# EAGLE design caps-lock-buzzer (EAGLE 7.7.0)
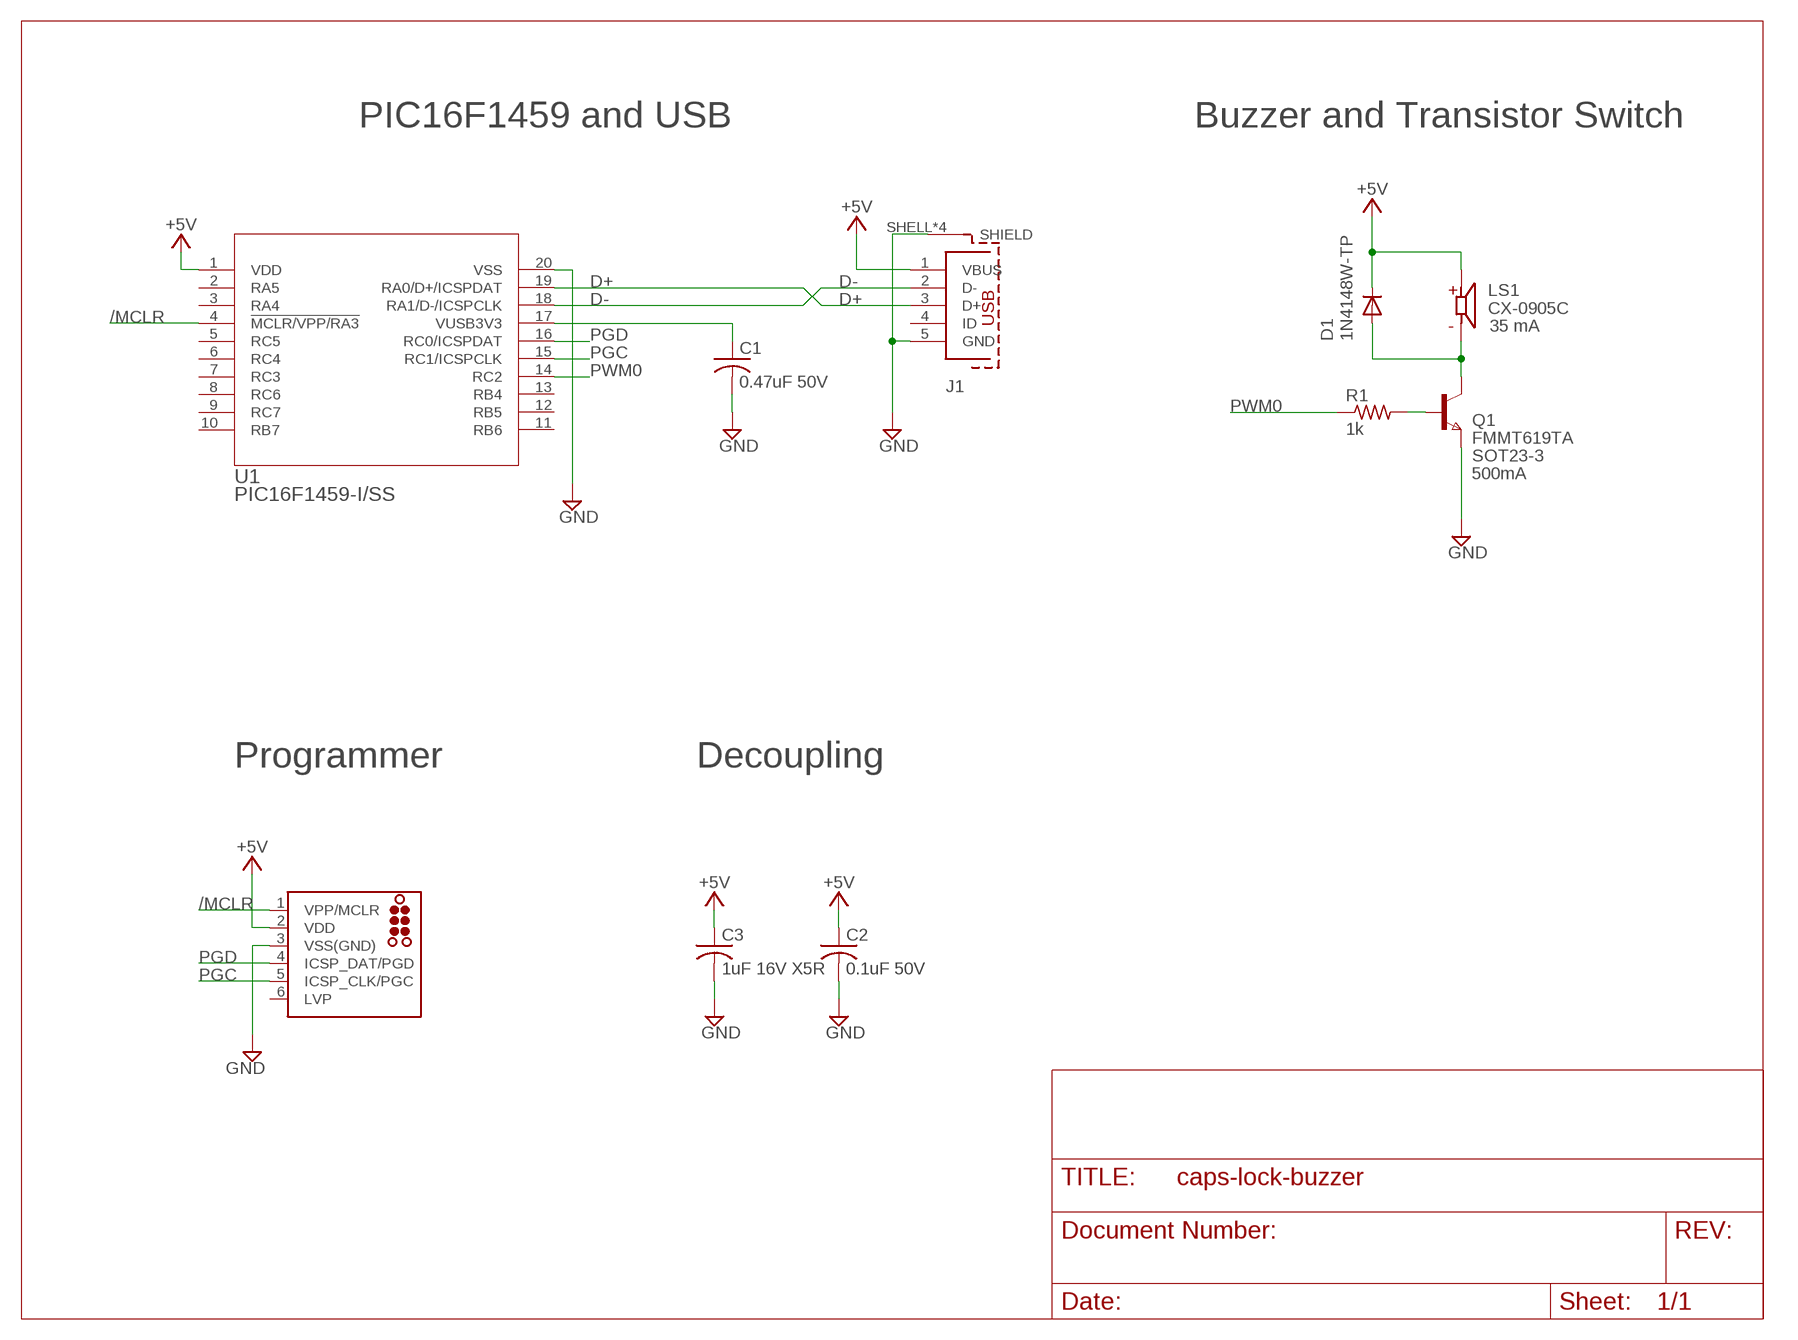
[diagram p0: schematic, sheet 1]

## Parts
C1  0.47uF 50V  C-USC1206K  [C1206K]
C2  0.1uF 50V  C-USC1206K  [C1206K]
C3  1uF 16V X5R  C-USC1210  [C1210]
D1  1N4148W-TP  DIODE-SOD123  [SOD123]
J1  629105136821  [629105136821]
J3  TC2030-MCP-NL  [TC2030-MCP-NL]
LS1  CX-0905C  [CUI_CX-0905C]
Q1  FMMT619TA  NPNSOT23  [SOT-23]
R1  1k  R-US_R0805  [R0805]
U1  PIC16F1459-I/SS  [SSOP20_MC]

## Nets
+5V: C2.1 C3.1 D1.C J1.1(VBUS) J3.2(VDD) LS1.P U1.1(VDD)
/MCLR: J3.1(VPP/MCLR) U1.4(!MCLR/VPP/RA3)
D+: J1.3(D+) U1.19(RA0/D+/ICSPDAT)
D-: J1.2(D-) U1.18(RA1/D-/ICSPCLK)
GND: C1.2 C2.2 C3.2 J1.5(GND) J1.SHELL1(SHIELD) J1.SHELL2(SHIELD) J1.SHELL3(SHIELD) J1.SHELL(SHIELD) J3.3(VSS(GND)) Q1.2(E) U1.20(VSS)
N$16: Q1.3(B) R1.2
OUT0: D1.A LS1.N Q1.1(C)
PGC: J3.5(ICSP_CLK/PGC) U1.15(RC1/ICSPCLK)
PGD: J3.4(ICSP_DAT/PGD) U1.16(RC0/ICSPDAT)
PWM0: R1.1 U1.14(RC2)
VUSB: C1.1 U1.17(VUSB3V3)
Unconnected: J1.4(ID) J3.6(LVP) U1.2(RA5) U1.3(RA4) U1.5(RC5) U1.6(RC4) U1.7(RC3) U1.8(RC6) U1.9(RC7) U1.10(RB7) U1.11(RB6) U1.12(RB5) U1.13(RB4)

## Notes on the sheet
- PIC16F1459 and USB | Buzzer and Transistor Switch
- 35 mA
- SOT23-3
- 500mA
- Programmer | Decoupling

## Library data of the parts
C1 = rcl:C-US: CAPACITOR, American symbol; MFR: KEMET; MFR_PART_NO: C1206C474K5RACTU
C2 = rcl:C-US: CAPACITOR, American symbol; MFR: KEMET; MFR_PART_NO: C1206S104M5RACTU
C3 = rcl:C-US: CAPACITOR, American symbol; MFR: KEMET; MFR_PART_NO: C1210C105K4PACTU
D1 = diode:DIODE-: DIODE
J1 = InputOutputIO (rev18a):629105136821: WR-COM SMT Horizontal 5 Contacts Micro USB Type B,5 pins=>Code : Con_I-O_COM_MicroUSB_629105136821 <http://katalog.we-online.de/media/images/eican/Con_I-O_COM_MicroUSB_629105136821_pf2.jpg> Details see: http://katalog.we-online.de/en/em/COM_MICRO_SMT_TYPE_B_HORIZONTAL/629105136821?m Created 2014-07-09, Karrer Zheng 2014 (C) Würth Elektronik
J3 = tag-connect:TC2030: TAG-CONNECT ICSP Connector Manufacturer: Tag-Connect <http://www.tag-connect.com> Cable for easy In-Circuit Serial Programming. Designed for Microchip ICD2, suitable for many others. Two variants - one "with legs" (for hands-free fit on PCB) and another "without legs" for quick programming. PAD Description 1 MCLR/Vpp 2 Vdd 3 GND 4 PGD (ISPDAT) 5 PGC (ISPCLK) 6 nc (used for LVP) ©2009 ROFA.cz - modified and updated by Robert Darlington ‹rdarlington@gmail.com›
LS1 = CX-0905C:CX-0905C: 9.6 mm, 5 V, 80 dB, 2.7 kHz, Through Hole, Sealed, Driving Circuit, Magnetic Audio Indicator Buzzer; AVAILABILITY: Good; DESCRIPTION: 9.6 mm, 5 V, 80 dB, 2.7 kHz, Through Hole, Sealed, Driving Circuit, Magnetic Audio Indicator Buzzer; MF: CUI; MP: CX-0905C; PACKAGE: CUI; PRICE: 1.32 USD
Q1 = zetex:NPNSOT23: NPN TRANSISTOR; MPN: DSS20201L-7; OC_FARNELL: 1710688; OC_NEWARK: 25R4555
R1 = rcl:R-US_: RESISTOR, American symbol
U1 = pic16f1459-i-ss:PIC16F1459-I/SS; MANUFACTURER_PART_NUMBER: PIC16F1459ISS; VENDOR: Microchip

## Board
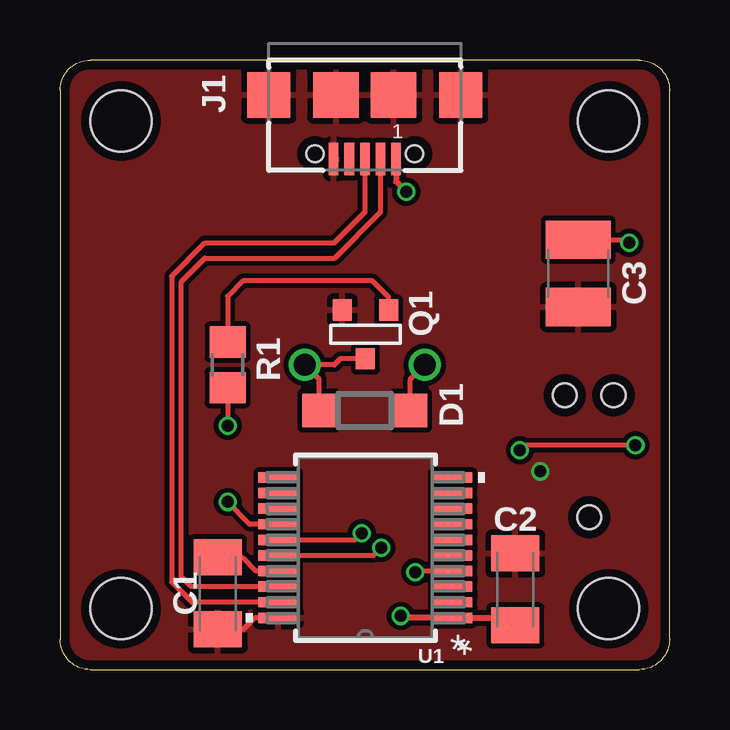
[diagram p1: board, top side]
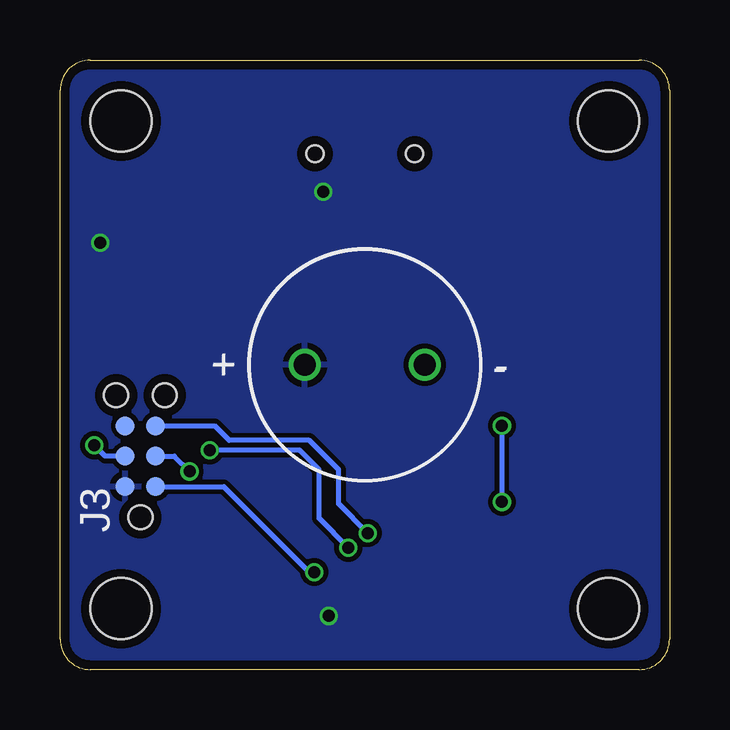
[diagram p2: board, bottom side, seen from below]

Size 25.4 x 25.4 mm. Coordinates in mm from the lower left corner, seen from the top.
Outline: 1.27,0 24.13,0 arc90 25.4,1.27 25.4,24.13 arc90 24.13,25.4 1.27,25.4 arc90 0,24.13 0,1.27 arc90 1.27,0
Copper layers (1*16): Top 0.035559375mm / dielectric 1.6mm / Bottom 0.035559375mm
Design rules "oshpark-2layer-2018": minimum track width 6mil, minimum drill 10mil, track to track 6mil, track to pad 6mil, pad to pad 6mil, via to via 6mil, smd to smd 6mil, copper to edge 15mil, drill to drill 6mil, minimum pad ring 5mil, minimum via ring 5mil, stop-mask expansion 2.5mil, vias tented up to drill 0mil, thermal gap 10mil
Holes 2.54 mm at 2.54,2.54 2.54,22.86 22.86,22.86 22.86,2.54
tKeepout: area 0,0 to 4.5,4.5; area 20.9,0 to 25.4,4.5; area 20.9,20.9 to 25.4,25.4; area 0,20.9 to 4.5,25.4
bKeepout: area 0,20.3 to 5.1,25.4; area 20.3,20.3 to 25.4,25.4; area 20.3,0 to 25.4,5.1; area 0,0 to 5.1,5.1

### Footprints (pad centres in the part's own frame; a part is rotated, then mirrored left to right if it is on the bottom)
C1206K = smd 1.5 x 2: 1 -1.5,0; 2 1.5,0
C1210 = smd 1.6 x 2.7: 1 -1.4,0; 2 1.4,0
SOD123 = smd 1.4 x 1.4: A 1.9,0; C -1.9,0
629105136821 = smd 0.4 x 1.35: 1 -1.3,2.675; 2 -0.65,2.675; 3 0,2.675; 4 0.65,2.675; 5 1.3,2.675 | smd 1.8 x 1.9: SHELL -4,0; SHELL3 4,0 | smd 1.9 x 1.9: SHELL1 -1.2,0; SHELL2 1.2,0 | hole 0.7: -2.075,2.45; 2.075,2.45
TC2030-MCP-NL = smd 0.787 x 0.787: 1 1.27,-0.635; 2 1.27,0.635; 3 2.54,-0.635; 4 2.54,0.635; 5 3.81,-0.635; 6 3.81,0.635 | hole 0.991: 0,0; 5.08,-1.016; 5.08,1.016
CUI_CX-0905C = drill 0.9: N 2.5,0; P -2.5,0
SOT-23 = smd 0.787 x 0.889: 1 0.025,-1.016; 2 -0.94,1.016; 3 0.991,1.016
R0805 = smd 1.3 x 1.5: 1 -0.95,0; 2 0.95,0
SSOP20_MC = smd 1.651 x 0.432: 1 -3.632,2.925; 2 -3.632,2.275; 3 -3.632,1.625; 4 -3.632,0.975; 5 -3.632,0.325; 6 -3.632,-0.325; 7 -3.632,-0.975; 8 -3.632,-1.625; 9 -3.632,-2.275; 10 -3.632,-2.925; 11 3.632,-2.925; 12 3.632,-2.275; 13 3.632,-1.625; 14 3.632,-0.975; 15 3.632,-0.325; 16 3.632,0.325; 17 3.632,0.975; 18 3.632,1.625; 19 3.632,2.275; 20 3.632,2.925

### Placement (x,y rotation side)
C1  6.58,3.17 270 top
C2  18.97,3.34 90 top
C3  21.59,16.51 270 top
D1  12.7,10.79 180 top
J1  12.7,23.95 180 top
J3  22.05,6.35 90 bottom
LS1  12.7,12.7 0 bottom
Q1  12.7,13.97 0 top
R1  6.99,12.7 90 top
U1  12.73,5.08 180 top

### Tracks (layer width: path | path; a pad name or v marks a point on that pad's centre or on a via)
+5V  (via drill 0.5)
  Top 0.203: C3.1 23.59,17.91 v23.72,17.78 | 18.34,2.15 C2.1 | D1.C 14.6,12.1 LS1.P
  Top 0.254: v14.2,2.23 14.28,2.15 U1.1 18.34,2.15 | J1.1 14,20.34 v14.43,19.91
  pour Bottom (isolate 0.203): 0,0 25.4,0 25.4,25.4 0,25.4
/MCLR  (via drill 0.5)
  Top 0.203: U1.4 14.85,4.11 v14.81,4.06
  Bottom 0.203: v14.81,4.06 15.01,4.06 18.57,7.62 J3.1
D+
  Top 0.203: U1.19 5.5,2.81 4.65,3.66 4.65,16.4 6.03,17.78 11.43,17.78 12.7,19.05 J1.3
D-
  Top 0.203: U1.18 5.46,3.46 5.05,3.86 5.05,16.17 6.03,17.14 11.45,17.14 13.35,19.05 J1.2
GND  (via drill 0.5)
  Top 0.203: C1.2 7.64,1.68 8.12,2.15 U1.20
  Bottom 0.203: J3.3 20.64,8.89 v20,8.26
  pour Top (isolate 0.203): 0,25.4 25.4,25.4 25.4,0 0,0
N$16
  Top 0.203: Q1.3 13.69,15.52 13.02,16.19 7.62,16.19 6.99,15.56 R1.2
OUT0
  Top 0.203: D1.A 10.8,12.1 LS1.N 11.43,12.7 11.68,12.95 Q1.1
PGC  (via drill 0.5)
  Top 0.203: U1.15 12.29,5.41 v12.57,5.69
  Bottom 0.203: v12.57,5.69 13.79,6.91 13.79,8.33 15.01,9.55 18.35,9.55 18.96,10.16 J3.5
PGD  (via drill 0.5)
  Top 0.203: U1.16 13.06,4.75 v13.39,5.08 | v23.98,9.35 19.37,9.35 v19.16,9.14
  Bottom 0.203: v13.39,5.08 14.61,6.3 14.61,8.33 15.42,9.14 v19.16,9.14 | J3.4 23.52,8.89 v23.98,9.35
PWM0  (via drill 0.5)
  Top 0.203: R1.1 v6.99,10.16 | U1.14 7.92,6.05 v6.99,6.99
  Bottom 0.203: v6.99,10.16 v6.99,6.99
VUSB
  Top 0.203: C1.1 7.59,4.67 8.16,4.11 U1.17

### Text on the board
_tsilk: J1 | C3 | Q1 | R1 | D1 | C2 | C1 | U1 | *
_bsilk: - | +